# EAGLE board Ice-LogicDeck1 (EAGLE 7.5.0), part 1 of 2
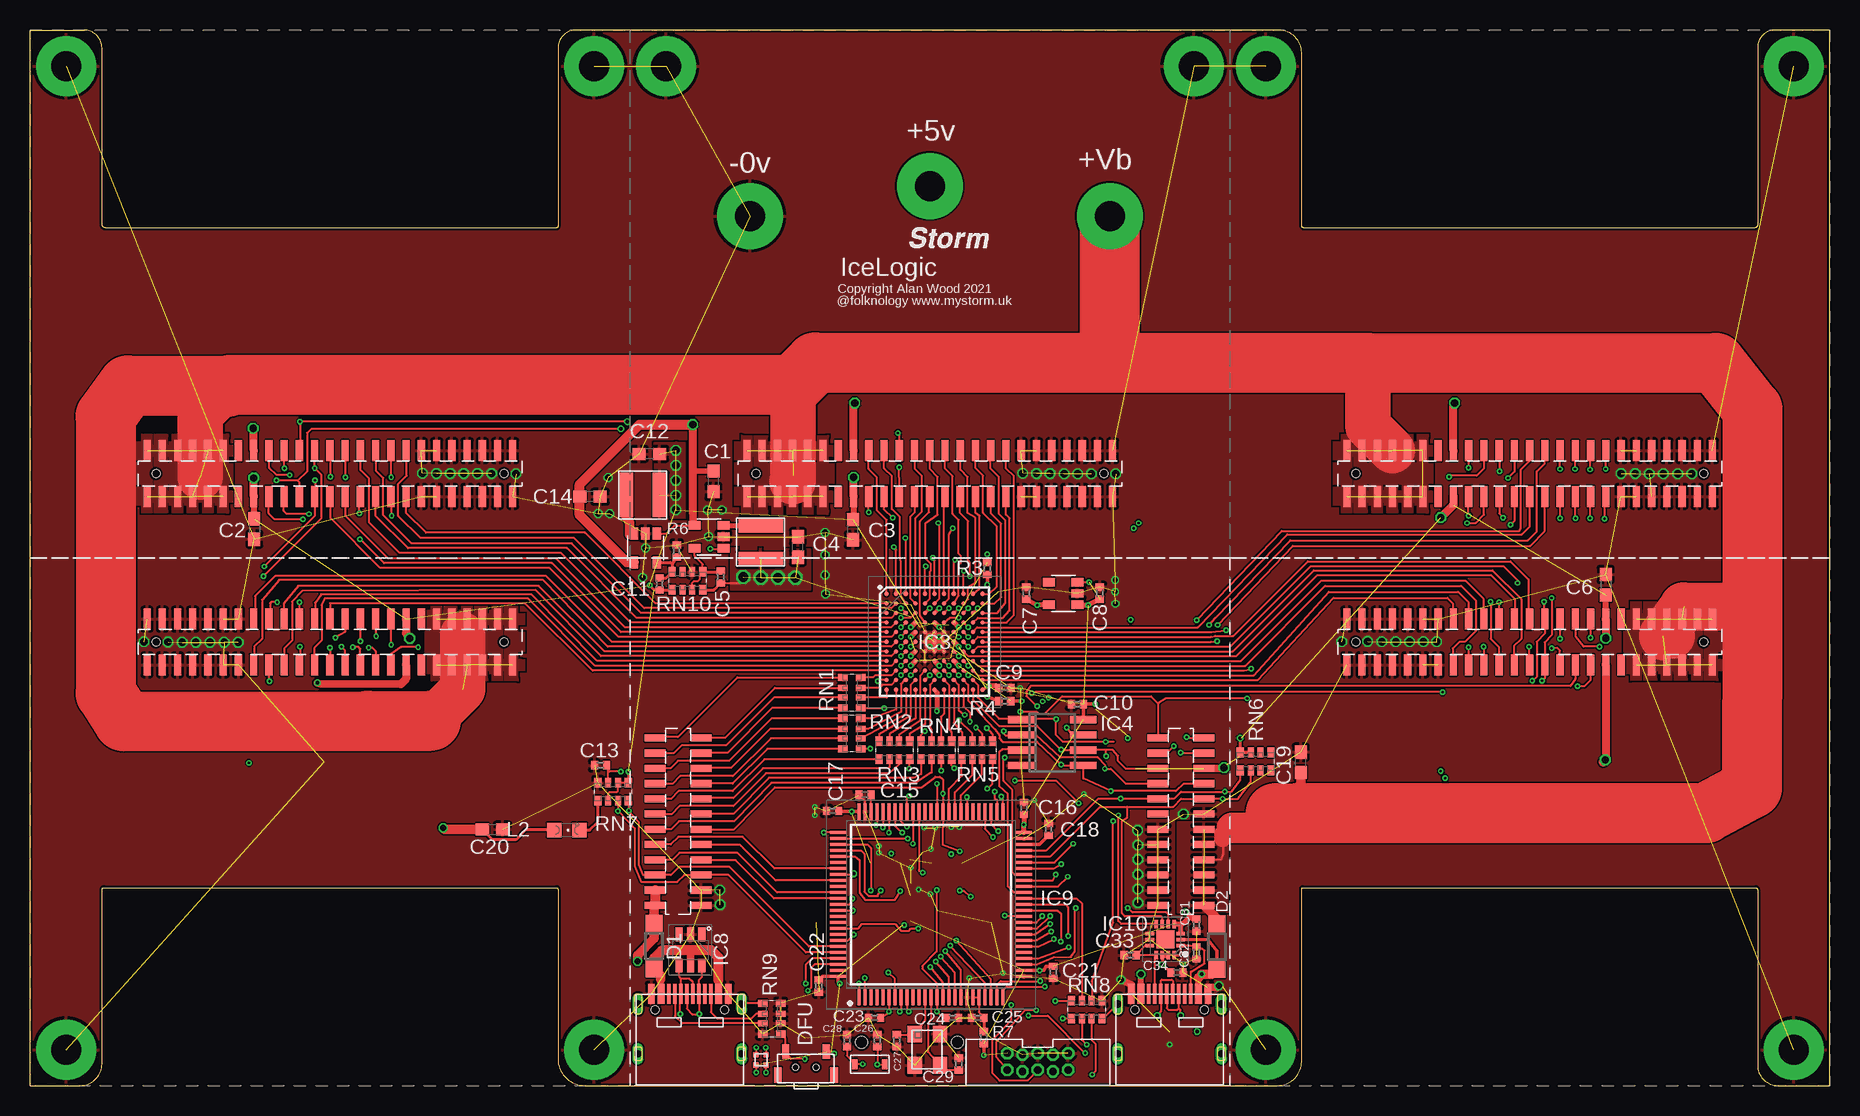
[diagram p1: board, top side]
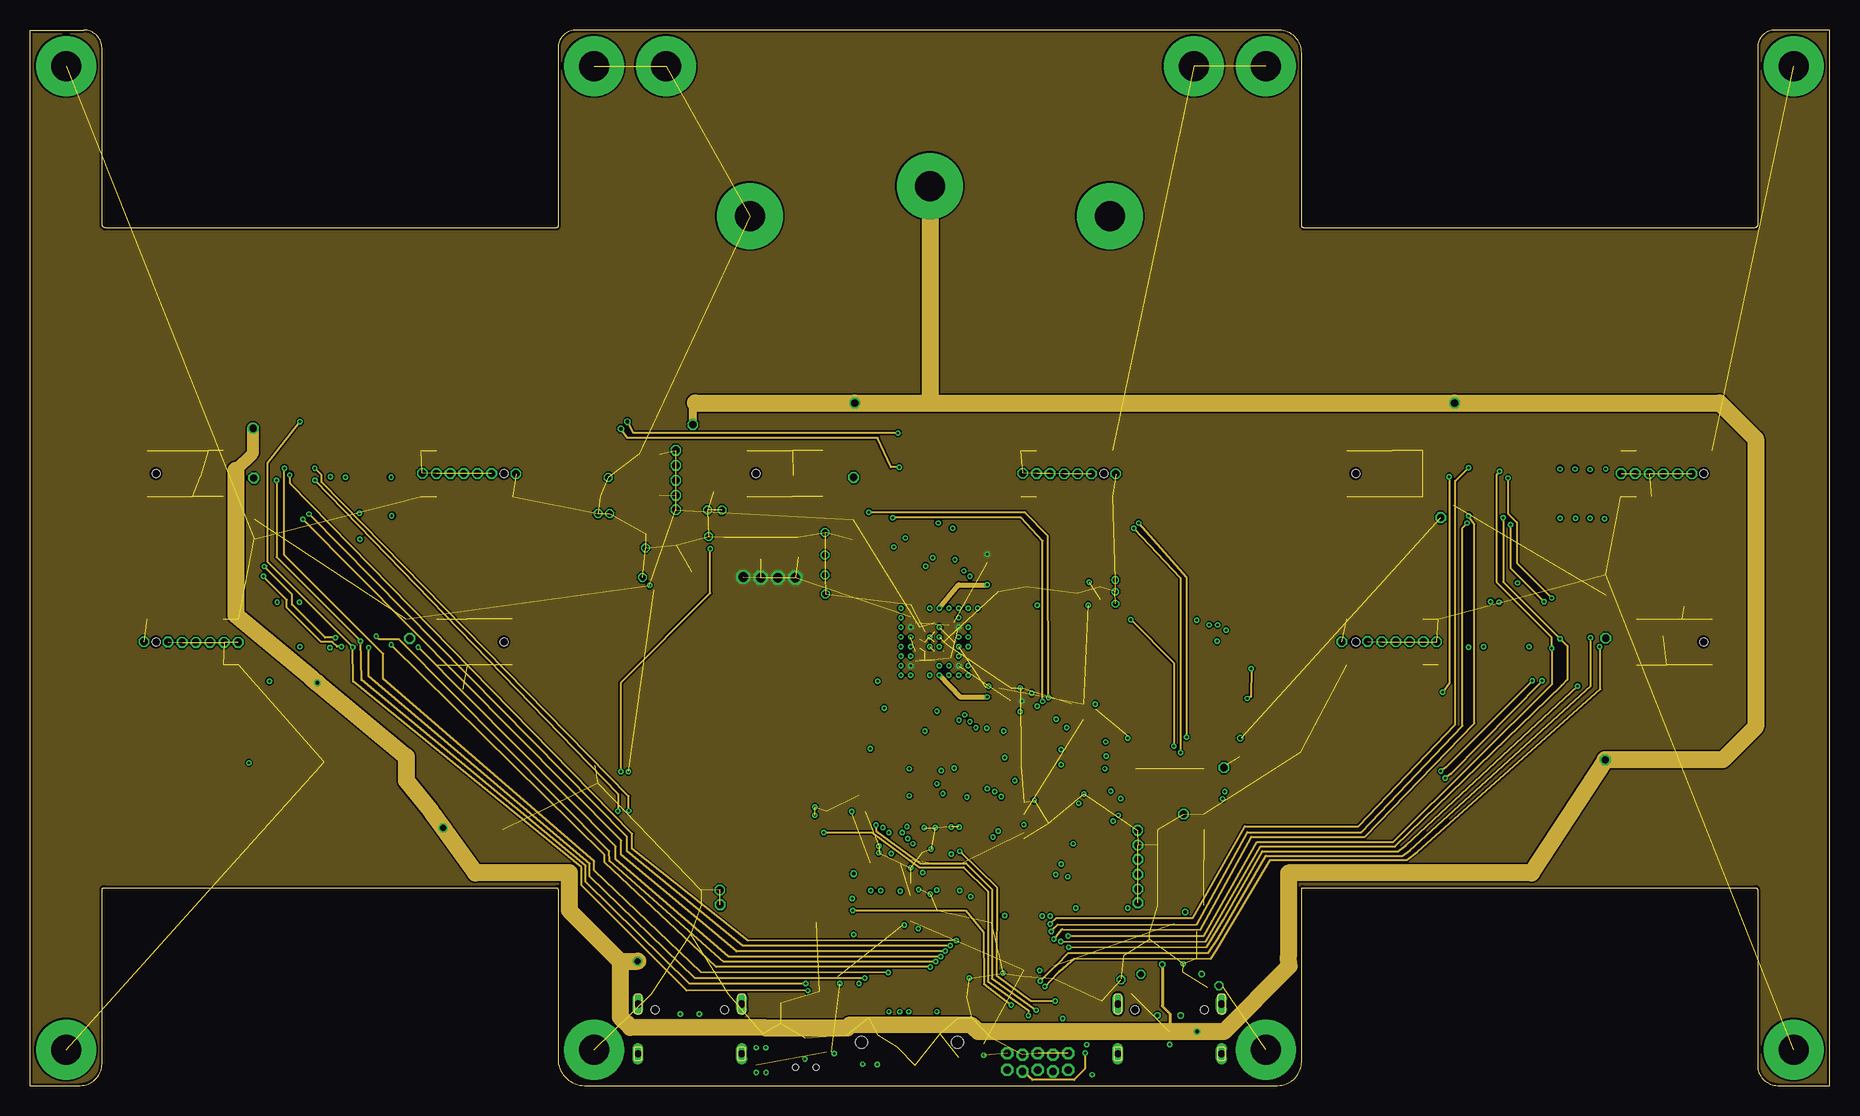
[diagram p2: board, inner layer Route2]
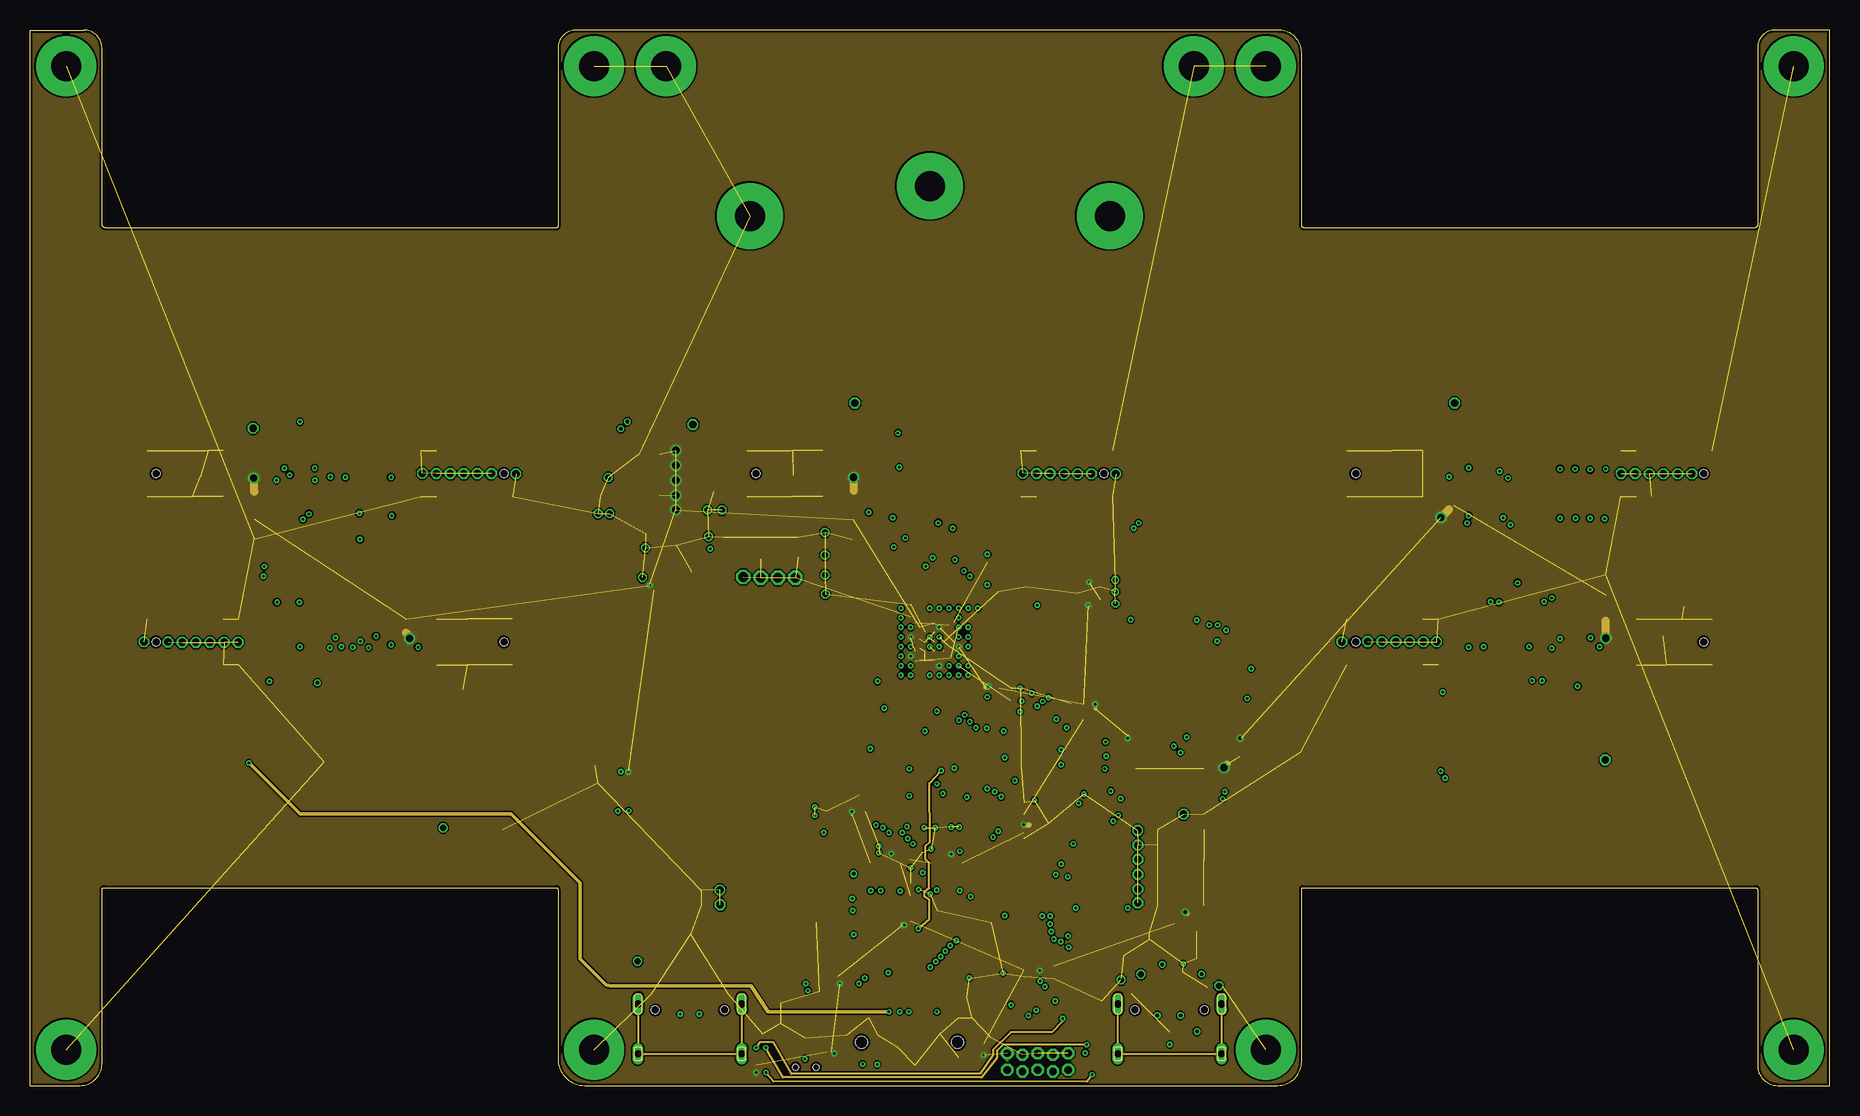
[diagram p3: board, inner layer Route15]
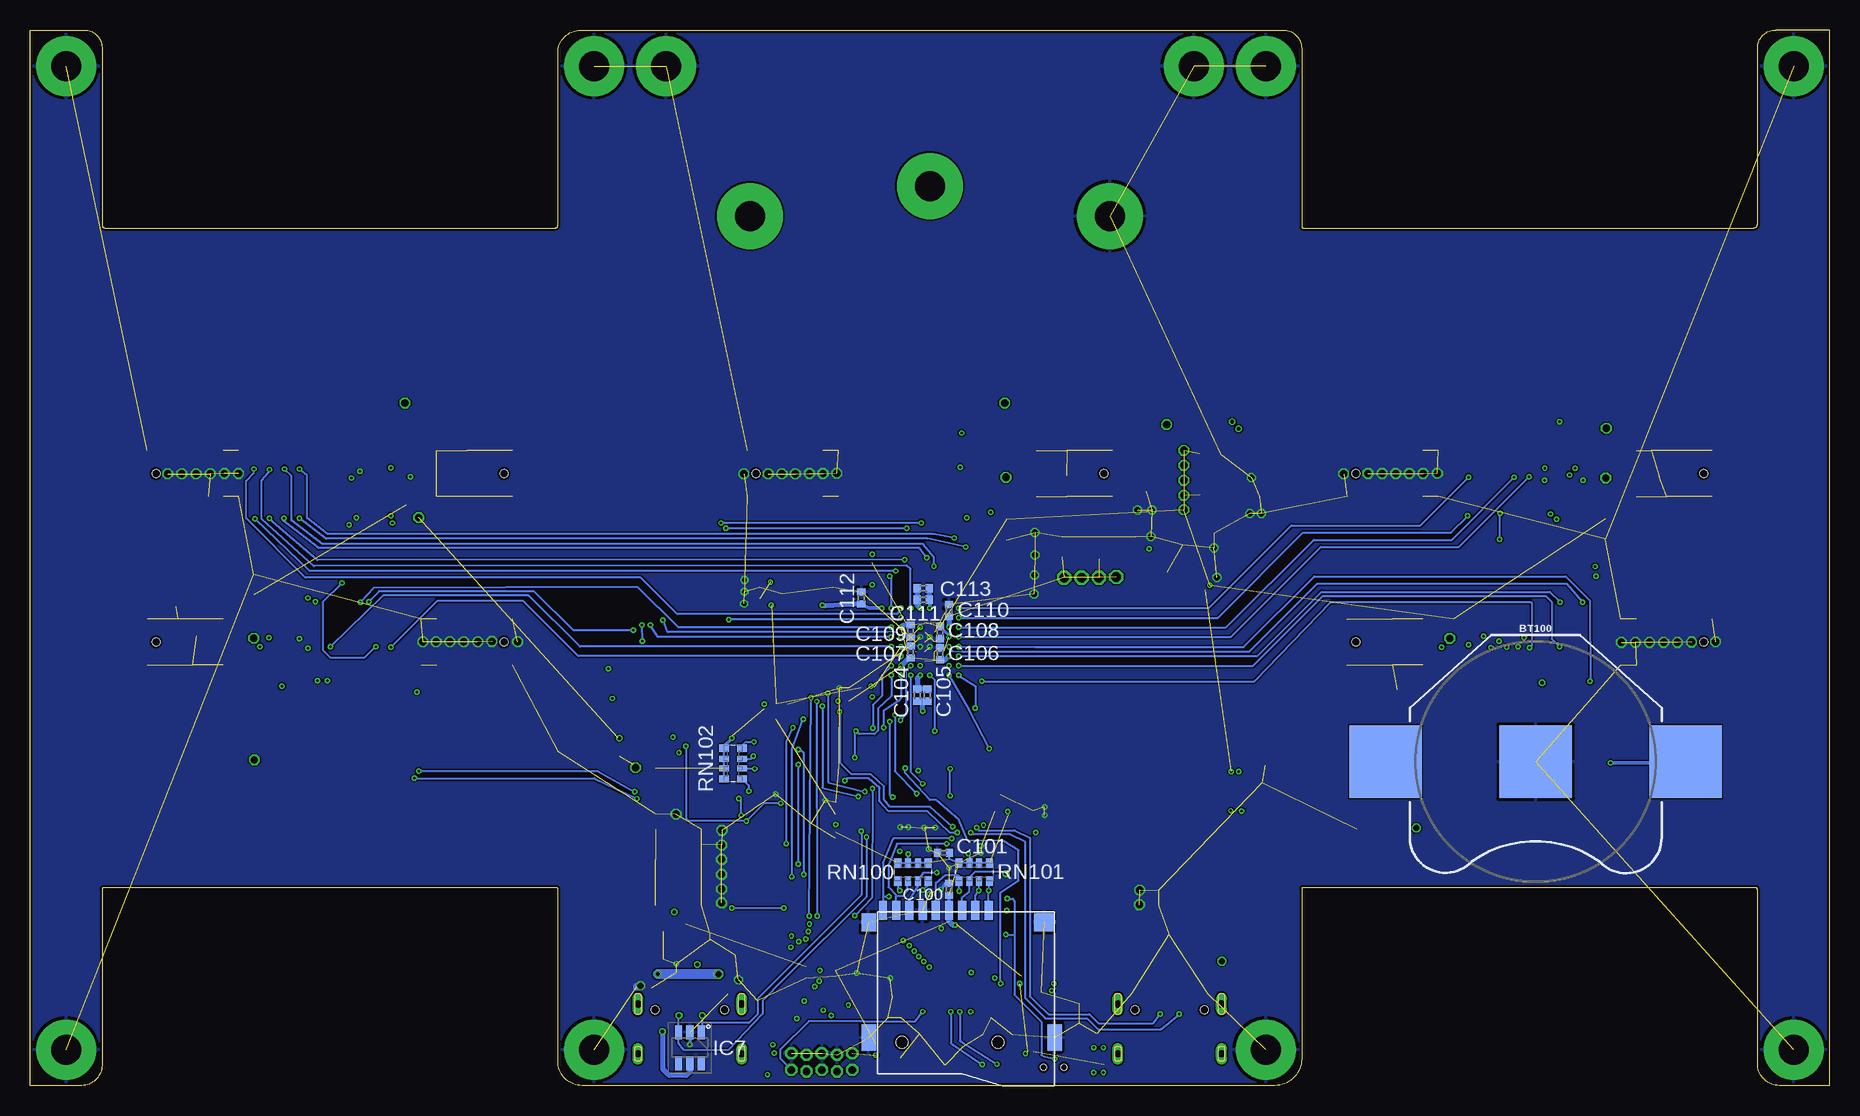
[diagram p4: board, bottom side, seen from below]

Size 150 x 88 mm. Coordinates in mm from the lower left corner, seen from the top.
Outline: 150,88 145.47,88 arc90 144,86.53 144,71.72 arc-90 143.78,71.5 106.2,71.5 arc-90 106,71.7 106,86.09 arc90 104.11,87.98 45.56,88 arc90 44,86.44 44,71.6 arc-90 43.9,71.5 6.31,71.5 arc-90 6,71.81 6,86.5 arc90 4.5,88 0,88 0,0 4.17,0 arc90 6,1.83 6,16.31 arc-90 6.19,16.5 43.88,16.5 arc-90 44,16.38 44,2.23 arc90 46.23,0 103.99,0 arc90 106,2.01 106,16.41 arc-90 106.09,16.5 143.83,16.5 arc-90 144,16.33 144,1.68 arc90 145.68,0 150,0 150,88
Copper layers (1*2*15*16): Top 0.035559375mm / dielectric 0.17018125mm / Route2 0.01778125mm / dielectric 47mil / Route15 0.01778125mm / dielectric 0.17018125mm / Bottom 0.035559375mm
Design rules "jcl-4layer *": minimum track width 3.5mil, minimum drill 0.2mm, track to track 5mil, track to pad 5mil, pad to pad 5mil, via to via 5mil, smd to smd 5mil, copper to edge 0.2mm, drill to drill 5mil, minimum pad ring 0.15mm, minimum via ring 0.125mm, stop-mask expansion 2.5mil, vias tented up to drill 0.3mm, thermal gap 10mil

## Footprints (pad centres in the part's own frame; a part is rotated, then mirrored left to right if it is on the bottom)
BATTCON_20MM = smd 6.07 x 6.07: 1 -12.5,0; 2 0,0; 3 12.5,0
C0603 = smd 1.1 x 1: 1 -0.85,0; 2 0.85,0
C0402 = smd 0.6 x 0.7: 1 -0.5,0; 2 0.5,0
USB-C = smd 0.28 x 1.7: CC1 -1.25,5; CC2 1.75,5; DN1 0.25,5; DN2 -0.75,5; DP1 -0.25,5; DP2 0.75,5; SBU1 1.25,5; SBU2 -1.75,5 | smd 0.56 x 1.7: GND@1 -3.2,5; GND@2 3.2,5; VBUS@1 -2.4,5; VBUS@2 2.4,5 | drill 0.6 long: P$1 -4.32,4.15; P$2 4.32,4.15; P$3 -4.32,0; P$4 4.32,0 | hole 0.65: -2.89,3.65; 2.89,3.65
1.27-2X5-HEADER = drill 0.6 pad 1.016 octagon: 1 -2.54,0; 2 -1.27,-0.127; 3 0,0; 4 1.27,-0.127; 5 2.54,0; 6 2.54,1.397; 7 1.27,1.27; 8 0,1.397; 9 -1.27,1.27; 10 -2.54,1.397
SOD123 = smd 1.4 x 1.4: A 1.9,0; C -1.9,0
4X3-RA-BUTTON = smd 0.6 x 1.2: P$1 -1.7,-2.6; P$2 1.7,-2.6 | smd 0.65 x 1.3: SH1 -2.35,-0.65; SH2 2.35,-0.65 | hole 0.5: -0.85,-1.3; 0.85,-1.3
2M5-LARGE = drill 2.5 pad 5.5: P$1 0,0
NRC4018 = smd 1.2 x 3.7: P$1 -1.4,0; P$2 1.4,0
TSOP-5/SOT23-5 = smd 0.7 x 1: 1 0.95,1.2; 2 0,1.2; 3 -0.95,1.2; 4 -0.95,-1.2; 5 0.95,-1.2
BGA121C80P11X11_900X900X110 = smd 0.37 x 0.37: A1 -4,4; A2 -3.2,4; A3 -2.4,4; A4 -1.6,4; A5 -0.8,4; A6 0,4; A7 0.8,4; A8 1.6,4; A9 2.4,4; A10 3.2,4; A11 4,4; B1 -4,3.2; B2 -3.2,3.2; B3 -2.4,3.2; B4 -1.6,3.2; B5 -0.8,3.2; B6 0,3.2; B7 0.8,3.2; B8 1.6,3.2; B9 2.4,3.2; B10 3.2,3.2; B11 4,3.2; C1 -4,2.4; C2 -3.2,2.4; C3 -2.4,2.4; C4 -1.6,2.4; C5 -0.8,2.4; C6 0,2.4; C7 0.8,2.4; C8 1.6,2.4; C9 2.4,2.4; C10 3.2,2.4; C11 4,2.4; D1 -4,1.6; D2 -3.2,1.6; D3 -2.4,1.6; D4 -1.6,1.6; D5 -0.8,1.6; D6 0,1.6; D7 0.8,1.6; D8 1.6,1.6; D9 2.4,1.6; D10 3.2,1.6; D11 4,1.6; E1 -4,0.8; E2 -3.2,0.8; E3 -2.4,0.8; E4 -1.6,0.8; E5 -0.8,0.8; E6 0,0.8; E7 0.8,0.8; E8 1.6,0.8; E9 2.4,0.8; E10 3.2,0.8; E11 4,0.8; F1 -4,0; F2 -3.2,0; F3 -2.4,0; F4 -1.6,0; F5 -0.8,0; F6 0,0; F7 0.8,0; F8 1.6,0; F9 2.4,0; F10 3.2,0; F11 4,0; G1 -4,-0.8; G2 -3.2,-0.8; G3 -2.4,-0.8; G4 -1.6,-0.8; G5 -0.8,-0.8; G6 0,-0.8; G7 0.8,-0.8; G8 1.6,-0.8; G9 2.4,-0.8; G10 3.2,-0.8; G11 4,-0.8; H1 -4,-1.6; H2 -3.2,-1.6; H3 -2.4,-1.6; H4 -1.6,-1.6; H5 -0.8,-1.6; H6 0,-1.6; H7 0.8,-1.6; H8 1.6,-1.6; H9 2.4,-1.6; H10 3.2,-1.6; H11 4,-1.6; J1 -4,-2.4; J2 -3.2,-2.4; J3 -2.4,-2.4; J4 -1.6,-2.4; J5 -0.8,-2.4; J6 0,-2.4; J7 0.8,-2.4; J8 1.6,-2.4; J9 2.4,-2.4; J10 3.2,-2.4; J11 4,-2.4; K1 -4,-3.2; K2 -3.2,-3.2; K3 -2.4,-3.2; K4 -1.6,-3.2; K5 -0.8,-3.2; K6 0,-3.2; K7 0.8,-3.2; K8 1.6,-3.2; K9 2.4,-3.2; K10 3.2,-3.2; K11 4,-3.2; L1 -4,-4; L2 -3.2,-4; L3 -2.4,-4; L4 -1.6,-4; L5 -0.8,-4; L6 0,-4; L7 0.8,-4; L8 1.6,-4; L9 2.4,-4; L10 3.2,-4; L11 4,-4
SOIC-8-NARROW = smd 0.6 x 2.2: 1 -1.905,-2.6; 2 -0.635,-2.6; 3 0.635,-2.6; 4 1.905,-2.6; 5 1.905,2.6; 6 0.635,2.6; 7 -0.635,2.6; 8 -1.905,2.6
SOT95P280X145-6N = smd 1.15 x 0.6: 1 -1.3,0.95; 2 -1.3,0; 3 -1.3,-0.95; 4 1.3,-0.95; 5 1.3,0; 6 1.3,0.95
QFP50P1600X1600X160-100N = smd 1.35 x 0.28: 1 -7.738,6; 2 -7.738,5.5; 3 -7.738,5; 4 -7.738,4.5; 5 -7.738,4; 6 -7.738,3.5; 7 -7.738,3; 8 -7.738,2.5; 9 -7.738,2; 10 -7.738,1.5; 11 -7.738,1; 12 -7.738,0.5; 13 -7.738,0; 14 -7.738,-0.5; 15 -7.738,-1; 16 -7.738,-1.5; 17 -7.738,-2; 18 -7.738,-2.5; 19 -7.738,-3; 20 -7.738,-3.5; 21 -7.738,-4; 22 -7.738,-4.5; 23 -7.738,-5; 24 -7.738,-5.5; 25 -7.738,-6; 51 7.738,-6; 52 7.738,-5.5; 53 7.738,-5; 54 7.738,-4.5; 55 7.738,-4; 56 7.738,-3.5; 57 7.738,-3; 58 7.738,-2.5; 59 7.738,-2; 60 7.738,-1.5; 61 7.738,-1; 62 7.738,-0.5; 63 7.738,0; 64 7.738,0.5; 65 7.738,1; 66 7.738,1.5; 67 7.738,2; 68 7.738,2.5; 69 7.738,3; 70 7.738,3.5; 71 7.738,4; 72 7.738,4.5; 73 7.738,5; 74 7.738,5.5; 75 7.738,6 | smd 0.28 x 1.35: 26 -6,-7.738; 27 -5.5,-7.738; 28 -5,-7.738; 29 -4.5,-7.738; 30 -4,-7.738; 31 -3.5,-7.738; 32 -3,-7.738; 33 -2.5,-7.738; 34 -2,-7.738; 35 -1.5,-7.738; 36 -1,-7.738; 37 -0.5,-7.738; 38 0,-7.738; 39 0.5,-7.738; 40 1,-7.738; 41 1.5,-7.738; 42 2,-7.738; 43 2.5,-7.738; 44 3,-7.738; 45 3.5,-7.738; 46 4,-7.738; 47 4.5,-7.738; 48 5,-7.738; 49 5.5,-7.738; 50 6,-7.738; 76 6,7.738; 77 5.5,7.738; 78 5,7.738; 79 4.5,7.738; 80 4,7.738; 81 3.5,7.738; 82 3,7.738; 83 2.5,7.738; 84 2,7.738; 85 1.5,7.738; 86 1,7.738; 87 0.5,7.738; 88 0,7.738; 89 -0.5,7.738; 90 -1,7.738; 91 -1.5,7.738; 92 -2,7.738; 93 -2.5,7.738; 94 -3,7.738; 95 -3.5,7.738; 96 -4,7.738; 97 -4.5,7.738; 98 -5,7.738; 99 -5.5,7.738; 100 -6,7.738
QFN50P250X250X80-15N = smd 0.7 x 0.3: 1 -1.3,0.5; 2 -1.3,0; 3 -1.3,-0.5; 8 1.3,-0.5; 9 1.3,0; 10 1.3,0.5 | smd 0.3 x 0.7: 4 -0.75,-1.3; 5 -0.25,-1.3; 6 0.25,-1.3; 7 0.75,-1.3; 11 0.75,1.3; 12 0.25,1.3; 13 -0.25,1.3; 14 -0.75,1.3 | smd 1.5 x 1.5: 15 0,0
RGB_LED_IMM = smd 0.45 x 0.45: A 0.425,0.425; B -0.425,0.425; G -0.425,-0.425; R 0.425,-0.425
CHIPLED_0805 = smd 1.2 x 1.2: A 0,-1.05; C 0,1.05
HYPER-TILE = smd 1.75 x 0.6: E1 -22.885,6.985; E2 -22.885,5.715; E3 -22.885,4.445; E4 -22.885,3.175; E5 -22.885,1.905; E6 -22.885,0.635; E7 -22.885,-0.635; E8 -22.885,-1.905; E9 -22.885,-3.175; E10 -22.885,-4.445; E11 -22.885,-5.715; E12 -22.885,-6.985; E13 -19.075,-6.985; E14 -19.075,-5.715; E15 -19.075,-4.445; E16 -19.075,-3.175; E17 -19.075,-1.905; E18 -19.075,-0.635; E19 -19.075,0.635; E20 -19.075,1.905; E21 -19.075,3.175; E22 -19.075,4.445; E23 -19.075,5.715; E24 -19.075,6.985; F1 19.025,6.985; F2 19.025,5.715; F3 19.025,4.445; F4 19.025,3.175; F5 19.025,1.905; F6 19.025,0.635; F7 19.025,-0.635; F8 19.025,-1.905; F9 19.025,-3.175; F10 19.025,-4.445; F11 19.025,-5.715; F12 19.025,-6.985; F13 22.835,-6.985; F14 22.835,-5.715; F15 22.835,-4.445; F16 22.835,-3.175; F17 22.835,-1.905; F18 22.835,-0.635; F19 22.835,0.635; F20 22.835,1.905; F21 22.835,3.175; F22 22.835,4.445; F23 22.835,5.715; F24 22.835,6.985
R0402 = smd 0.6 x 0.7: 1 -0.5,0; 2 0.5,0
EXB38V = smd 0.6 x 0.8: 1 -1.275,-0.75; 4 1.275,-0.75; 5 1.275,0.75; 8 -1.275,0.75 | smd 0.5 x 0.8: 2 -0.4,-0.75; 3 0.4,-0.75; 6 0.4,0.75; 7 -0.4,0.75
SDCARD = smd 0.7 x 1.6: P$1 -5.5,1.1; P$2 -4.4,1.1; P$3 -3.3,1.1; P$4 -2.2,1.1; P$5 -1.1,1.1; P$6 0,1.1; P$7 1.1,1.1; P$8 2.2,1.1; P$9 3.3,1.1 | smd 1.2 x 1.5: P$10 -6.7,0.1 | smd 1.6 x 1.5: P$11 7.9,0.1 | smd 1.2 x 2.2: P$12 -6.7,-9.5; P$13 8.8,-9.5 | hole 1: -3.9,-9.9; 4.1,-9.9
UTILE_LP = drill 2.5 pad 5: 0V@1 22.5,22; 0V@2 22.5,-22 | smd 1.75 x 0.6: P$1 -13.385,-15.24; P$2 -13.385,-13.97; P$3 -13.385,-12.7; P$4 -13.385,-11.43; P$5 -13.385,-10.16; P$6 -13.385,-8.89; P$7 -13.385,-7.62; P$8 -13.385,-6.35; P$9 -13.385,-5.08; P$10 -13.385,-3.81; P$11 -13.385,-2.54; P$12 -13.385,-1.27; P$13 -13.385,0; P$14 -13.385,1.27; P$15 -13.385,2.54; P$16 -13.385,3.81; P$17 -13.385,5.08; P$18 -13.385,6.35; P$19 -13.385,7.62; P$20 -13.385,8.89; P$21 -13.385,10.16; P$22 -13.385,11.43; P$23 -13.385,12.7; P$24 -13.385,13.97; P$25 -13.385,15.24; P$26 -9.575,-15.24; P$27 -9.575,-13.97; P$28 -9.575,-12.7; P$29 -9.575,-11.43; P$30 -9.575,-10.16; P$31 -9.575,-8.89; P$32 -9.575,-7.62; P$33 -9.575,-6.35; P$34 -9.575,-5.08; P$35 -9.575,-3.81; P$36 -9.575,-2.54; P$37 -9.575,-1.27; P$38 -9.575,0; P$39 -9.575,1.27; P$40 -9.575,2.54; P$41 -9.575,3.81; P$42 -9.575,5.08; P$43 -9.575,6.35; P$44 -9.575,7.62; P$45 -9.575,8.89; P$46 -9.575,10.16; P$47 -9.575,11.43; P$48 -9.575,12.7; P$49 -9.575,13.97; P$50 -9.575,15.24 | hole 0.65: -11.48,14.5; -11.48,-14.5
CRYSTAL-3.2X2.5 = smd 1.4 x 1.2: 1 -1.3,-1; 2 1.3,-1; 3 1.3,1.1; 4 -1.3,1.1
FC135 = smd 0.45 x 0.8: P$1 -1.25,0; P$2 1.25,0

## Placement (x,y rotation side)
BT100  [BATTCON_20MM]  24.5,27 180 bottom
C1  22uf  [C0603]  56.98,50.38 90 top
C2  22uf  [C0603]  18.7,46.4 270 top
C3  22uf  [C0603]  68.6,46.35 90 top
C4  22uf  [C0603]  64,44.9 90 top
C5  22pf  [C0402]  57.58,42.4 270 top
C6  22uf  [C0603]  131.35,41.75 270 top
C7  470nf  [C0402]  83.05,41.05 270 top
C8  470nf  [C0402]  89.17,41.05 270 top
C9  470nf  [C0402]  81.25,33.15 0 top
C10  470nf  [C0402]  87.3,31.8 180 top
C11  22pf  [C0402]  52.48,41.83 270 top
C12  22uf  [C0603]  51.62,52.65 180 top
C13  470nf  [C0402]  47.55,26.7 180 top
C14  22uf  [C0603]  46.67,49.1 180 top
C15  470nf  [C0402]  69.6,24.25 180 top
C16  470nf  [C0402]  82.85,23.1 270 top
C17  470nf  [C0402]  66.9,22.9 0 top
C18  470nf  [C0402]  84.9,21.35 270 top
C19  22uf  [C0603]  105.92,26.95 90 top
C20  22uf  [C0603]  38.55,21.35 0 top
C21  470nf  [C0402]  85.3,9.45 90 top
C22  470nf  [C0402]  65.75,8.3 90 top
C23  470nf  [C0402]  70.4,5.65 180 top
C24  470nf  [C0402]  76.9,5.65 180 top
C25  4u7  [C0402]  79,5.65 180 top
C26  15pf  [C0402]  70.62,3.75 270 top
C27  22pf  [C0402]  72.25,3.75 90 top
C28  15pf  [C0402]  68.1,3.75 270 top
C29  22pf  [C0402]  77.42,1.8 270 top
C31  470nf  [C0402]  97.22,13.38 90 top
C32  470pf  [C0402]  97.22,11.07 90 top
C33  470pf  [C0402]  91.7,10.88 180 top
C34  470nf  [C0402]  95.6,9.43 180 top
C100  470nf  [C0402]  73.4,16.35 90 bottom
C101  4u7  [C0402]  73.85,19.4 0 bottom
C104  470nf  [C0402]  76.03,32.55 90 bottom
C105  4u7  [C0402]  75.2,32.55 90 bottom
C106  470nf  [C0402]  74.15,36 90 bottom
C107  470nf  [C0402]  76.6,36.15 270 bottom
C108  470nf  [C0402]  74.15,37.75 270 bottom
C109  470nf  [C0402]  76.6,37.9 90 bottom
C110  470nf  [C0402]  73.4,39.6 270 bottom
C111  470nf  [C0402]  75.55,40.5 180 bottom
C112  470nf  [C0402]  80.7,40.65 90 bottom
C113  4u7  [C0402]  75.55,41.45 180 bottom
CN1  USB-C-16  [USB-C]  55,2.65 0 top
CN2  USB-C-16  [USB-C]  95,2.65 0 top
CN3  2X5-HEADER  [1.27-2X5-HEADER]  84,1.3 0 top
D1  [SOD123]  52.02,11.62 270 top
D2  [SOD123]  98.92,11.57 270 top
DFU  4X3-RA-BUTTON  [4X3-RA-BUTTON]  64.67,0.23 180 top
H1  HOLE2.5MM-LARGE  [2M5-LARGE]  75,75 0 top
H3  HOLE2.5MM-LARGE  [2M5-LARGE]  60,72.5 0 top
H4  HOLE2.5MM-LARGE  [2M5-LARGE]  90,72.5 0 top
I1  NRS4018  [NRC4018]  60.9,45.3 270 top
I2  NRS4018  [NRC4018]  51.08,49.25 0 top
IC1  [TSOP-5/SOT23-5]  56.6,45.75 270 top
IC2  NCP114  [TSOP-5/SOT23-5]  86.12,41.02 270 top
IC3  ICE40HX4K-BG121  [BGA121C80P11X11_900X900X110]  75.4,37 0 top
IC4  AT25SDF041A  [SOIC-8-NARROW]  85.2,28.6 270 top
IC5  [TSOP-5/SOT23-5]  51.3,44.83 0 top
IC7  USBLC6-2SC6  [SOT95P280X145-6N]  95,3.15 270 bottom
IC8  USBLC6-2SC6  [SOT95P280X145-6N]  55.05,11.3 270 top
IC9  STM32F750V8T6  [QFP50P1600X1600X160-100N]  75.1,15.1 90 top
IC10  FUSB302MPX  [QFN50P250X250X80-15N]  94.62,12.18 180 top
L1  RGB_LED  [RGB_LED_IMM]  60.92,2.14 180 top
L2  [CHIPLED_0805]  44.75,21.3 270 top
MEZZANINE  HYPER-TILECARRIER  [HYPER-TILE]  75,22 0 top
R3  100r  [R0402]  79.8,43.1 270 top
R4  100r  [R0402]  81.25,32.05 0 top
R6  27k  [R0402]  53.9,44.58 90 top
R7  100r  [R0402]  79.5,4 270 top
RN1  22r  [EXB38V]  68.5,32.75 270 top
RN2  22r  [EXB38V]  68.5,29.35 270 top
RN3  22r  [EXB38V]  72.05,27.95 0 top
RN4  22r  [EXB38V]  75.55,27.95 0 top
RN5  22r  [EXB38V]  78.95,27.95 0 top
RN6  2k4  [EXB38V]  102.15,27.02 180 top
RN7  2k4  [EXB38V]  48.6,24.5 180 top
RN8  1k5  [EXB38V]  88.08,6.33 0 top
RN9  5k1  [EXB38V]  61.83,5.58 90 top
RN10  120k  [EXB38V]  54.8,42.08 180 top
RN100  10k  [EXB38V]  76.4,17.8 0 bottom
RN101  10k  [EXB38V]  71.3,17.8 0 bottom
RN102  10k  [EXB38V]  91.4,26.85 90 bottom
SD100  TF-15X15  [SDCARD]  73.4,13.5 0 bottom
TILE1  UTILE_LPCARRIER_SMD_MALE_1.27  [UTILE_LP]  25,62.5 90 top
TILE2  UTILE_LPCARRIER_SMD_MALE_1.27  [UTILE_LP]  75,62.5 90 top
TILE3  UTILE_LPCARRIER_SMD_MALE_1.27  [UTILE_LP]  125,62.5 90 top
TILE4  UTILE_LPCARRIER_SMD_MALE_1.27  [UTILE_LP]  25,25.5 270 top
TILE5  UTILE_LPCARRIER_SMD_MALE_1.27  [UTILE_LP]  125,25.5 270 top
Y1  12MZ  [CRYSTAL-3.2X2.5]  74.75,3 270 top
Y2  FC-135  [FC135]  70,1.77 180 top